# Altium project CW308T_MPC57.PrjPcb
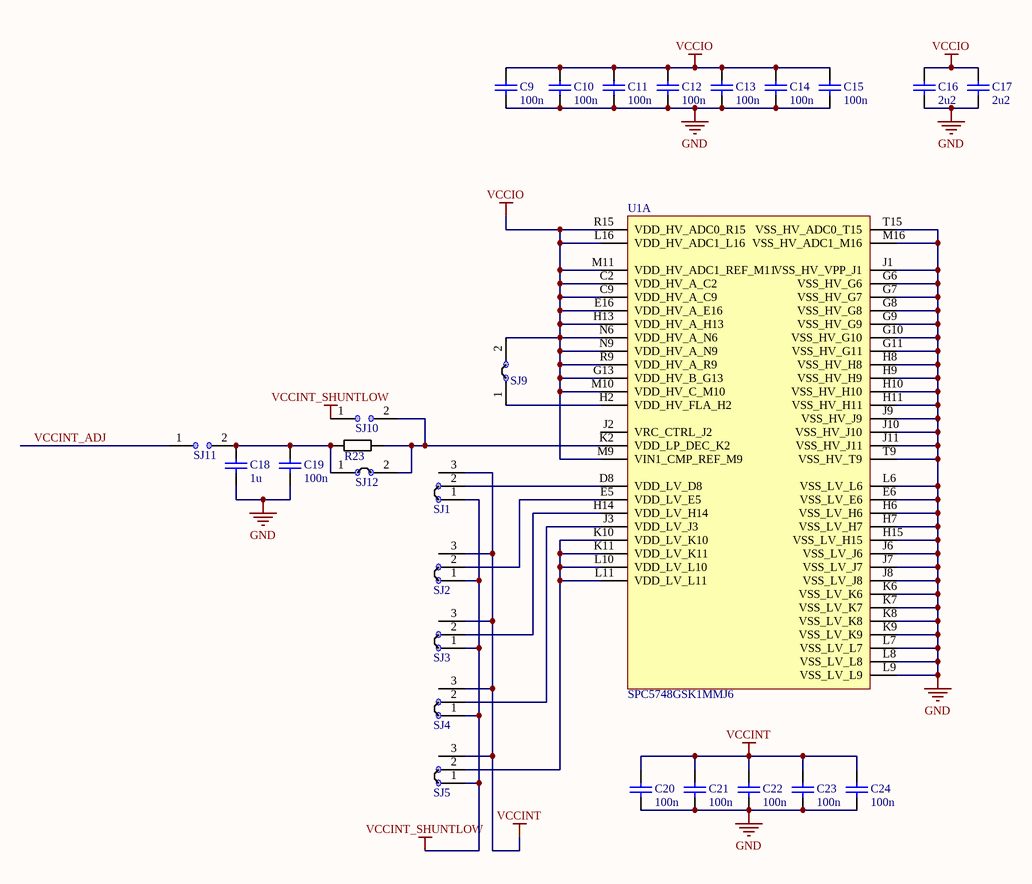
[diagram p0: mpc57_mcupower.SchDoc]
PrjLicense: GPL; PrjName: CW308T-MPC5748G; PrjRev: 02
6 sheets, 90 parts. Net scope: global (net labels, ports and power ports of the same name join across sheets).
Board file: CW308T_MPC57.PcbDoc
Sheets:
  mpc57_mcupower.SchDoc
  mpc57_cwconn.SchDoc
  mpc57_can.SchDoc
  mpc57_cpuio1.SchDoc
  mpc57_cpuio2.SchDoc
  mpc57_clk.SchDoc

## Sheet mpc57_mcupower.SchDoc: MCU Power
size Letter; Organization: NewAE Technology Inc.; Address1: 1083 Queen St., Suite 196; Address2: Halifax; Address3: NS; Address4: Canada B3H 0B2; SheetApproved: YES

### Parts
C9  100n  [CAPC0402_M]
C10  100n  [CAPC0402_M]
C11  100n  [CAPC0402_M]
C12  100n  [CAPC0402_M]
C13  100n  [CAPC0402_M]
C14  100n  [CAPC0402_M]
C15  100n  [CAPC0402_M]
C16  2u2  [CAPC0603_M]
C17  2u2  [CAPC0603_M]
C18  1u  [CAPC0603_M]
C19  100n  [CAPC0402_M]
C20  100n  [CAPC0402_M]
C21  100n  [CAPC0402_M]
C22  100n  [CAPC0402_M]
C23  100n  [CAPC0402_M]
C24  100n  [CAPC0402_M]
R23  1R0  [RESC1608X55N]  (value not drawn)
SJ1  NC  [SJ_3S_NC12]  (value not drawn)  (no BOM)
SJ2  NC  [SJ_3S_NC12]  (value not drawn)  (no BOM)
SJ3  NC  [SJ_3S_NC12]  (value not drawn)  (no BOM)
SJ4  NC  [SJ_3S_NC12]  (value not drawn)  (no BOM)
SJ5  NC  [SJ_3S_NC12]  (value not drawn)  (no BOM)
SJ9  NC  [SJ_2S_NC]  (value not drawn)  (no BOM)
SJ10  NO  [SJ_2S_NO]  (value not drawn)  (no BOM)
SJ11  NO  [SJ_2S_NO]  (value not drawn)  (no BOM)
SJ12  NC  [SJ_2S_NC]  (value not drawn)  (no BOM)
U1  SPC5748GSK1MMJ6  [BGA256C100P16X16_1700X1700X170]  (part A of 5)

### Nets
GND: C9.2 C10.2 C11.2 C12.2 C13.2 C14.2 C15.2 C16.2 C17.2 C18.2 C19.2 C20.2 C21.2 C22.2 C23.2 C24.2 U1.E6(VSS_LV_E6) U1.G6(VSS_HV_G6) U1.G7(VSS_HV_G7) U1.G8(VSS_HV_G8) U1.G9(VSS_HV_G9) U1.G10(VSS_HV_G10) U1.G11(VSS_HV_G11) U1.H6(VSS_LV_H6) U1.H7(VSS_LV_H7) U1.H8(VSS_HV_H8) U1.H9(VSS_HV_H9) U1.H10(VSS_HV_H10) U1.H11(VSS_HV_H11) U1.H15(VSS_LV_H15) U1.J1(VSS_HV_VPP_J1) U1.J6(VSS_LV_J6) U1.J7(VSS_LV_J7) U1.J8(VSS_LV_J8) U1.J9(VSS_HV_J9) U1.J10(VSS_HV_J10) U1.J11(VSS_HV_J11) U1.K6(VSS_LV_K6) U1.K7(VSS_LV_K7) U1.K8(VSS_LV_K8) U1.K9(VSS_LV_K9) U1.L6(VSS_LV_L6) U1.L7(VSS_LV_L7) U1.L8(VSS_LV_L8) U1.L9(VSS_LV_L9) U1.M16(VSS_HV_ADC1_M16) U1.T9(VSS_HV_T9) U1.T15(VSS_HV_ADC0_T15)
VCCINT: C20.1 C21.1 C22.1 C23.1 C24.1 SJ1.3 SJ2.3 SJ3.3 SJ4.3 SJ5.3
VCCINT_SHUNTLOW: SJ1.1 SJ2.1 SJ3.1 SJ4.1 SJ5.1 SJ10.1
VCCIO: C9.1 C10.1 C11.1 C12.1 C13.1 C14.1 C15.1 C16.1 C17.1 SJ9.2 U1.C2(VDD_HV_A_C2) U1.C9(VDD_HV_A_C9) U1.E16(VDD_HV_A_E16) U1.G13(VDD_HV_B_G13) U1.H13(VDD_HV_A_H13) U1.L16(VDD_HV_ADC1_L16) U1.M9(VIN1_CMP_REF_M9) U1.M10(VDD_HV_C_M10) U1.M11(VDD_HV_ADC1_REF_M11) U1.N6(VDD_HV_A_N6) U1.N9(VDD_HV_A_N9) U1.R9(VDD_HV_A_R9) U1.R15(VDD_HV_ADC0_R15)
VCCINT_ADJ: SJ11.1
NetC18_1: C18.1 C19.1 R23.1 SJ11.2 SJ12.1
NetR23_2: R23.2 SJ10.2 SJ12.2 U1.K2(VDD_LP_DEC_K2)
NetSJ1_2: SJ1.2 U1.D8(VDD_LV_D8)
NetSJ2_2: SJ2.2 U1.E5(VDD_LV_E5)
NetSJ3_2: SJ3.2 U1.H14(VDD_LV_H14)
NetSJ4_2: SJ4.2 U1.J3(VDD_LV_J3)
NetSJ5_2: SJ5.2 U1.K10(VDD_LV_K10) U1.K11(VDD_LV_K11) U1.L10(VDD_LV_L10) U1.L11(VDD_LV_L11)
NetSJ9_1: SJ9.1 U1.H2(VDD_HV_FLA_H2)

Not connected (* = marked no-connect by the designer): U1 J2(VRC_CTRL_J2)

### Notes on the sheet
- Title:
- Date:
- Rev:
- Time:
- Project:
- Sheet
- of
- License:
- Copyright © NewAE Technology Inc.
- Approved:
- NewAE.com
- File:

### Library data of the parts
C9-C15 C19-C24 = CCHIP-100n-0402: 100n, 0402; Case-EIA: 0402; Part Number: CCHIP-100n-0402; Component Kind: Standard; Component Type: Standard; Footprint: 0402; Pin Count: 2; Value: 100n; Mounting Technology: SMT
C16 C17 = CCHIP-2u2-0603: 2u2, 0603; Case-EIA: 0603; Case-Metric: 1608; Part Number: CCHIP-2u2-0603; Component Kind: Standard; Component Type: Standard; Footprint: 0603; Pin Count: 2; Value: 2u2; Mounting Technology: SMT
C18 = CCHIP-1u-0603: 1u, 0603; Case-EIA: 0603; Case-Metric: 1608; Part Number: CCHIP-1u-0603; Component Kind: Standard; Component Type: Standard; Footprint: 0603; Pin Count: 2; Value: 1u; Mounting Technology: SMT
R23 = RCHIP-1R0-0603: 1R0 res, 0603, 1%, 1/10W; Manufacture 1: Yageo; Manufacture Part Number 1: RC0603FR-071RL; Case-EIA: 0603; Case-Metric: 1608; Rated Power: 0.1W; Rated Voltage: 75VDC; Part Number: RCHIP-1R0-0603; Component Kind: Standard; Component Type: Standard; Footprint: 0603; Pin Count: 2; Supplier 1: Digi-Key; Supplier Part Number 1: 311-1.00HRCT-ND; Value: 1R0; Tolerance: 1%; Mounting Technology: SMT; Temperature Range: -55C to 155C
SJ1-SJ5 = SJ_3S_12JMP: Solder Jumper, NC; Part Number: SJ_3S_12JMP; Component Type: Standard (No BOM); Pin Count: 3
SJ9 SJ12 = SJ_2S: Solder Jumper, NC; Part Number: SJ_2S; Component Type: Standard (No BOM); Pin Count: 2
SJ10 SJ11 = SJ_2S_NO: Solder Jumper, NO; Part Number: SJ_2S_NO; Component Type: Standard (No BOM); Pin Count: 2; Mounting Technology: COPPER
U1 = SPC5748GSK1MMJ6: Freescale 32-bit MCU, Triple core, 6MB Flash, 160MHz, -40/+125degC, Automotive Qualified, BGA 256

## Sheet mpc57_cwconn.SchDoc: CW308 UFO Connectors
size Letter; Organization: NewAE Technology Inc.; Address1: 1083 Queen St., Suite 196; Address2: Halifax; Address3: NS; Address4: Canada B3H 0B2; SheetApproved: YES
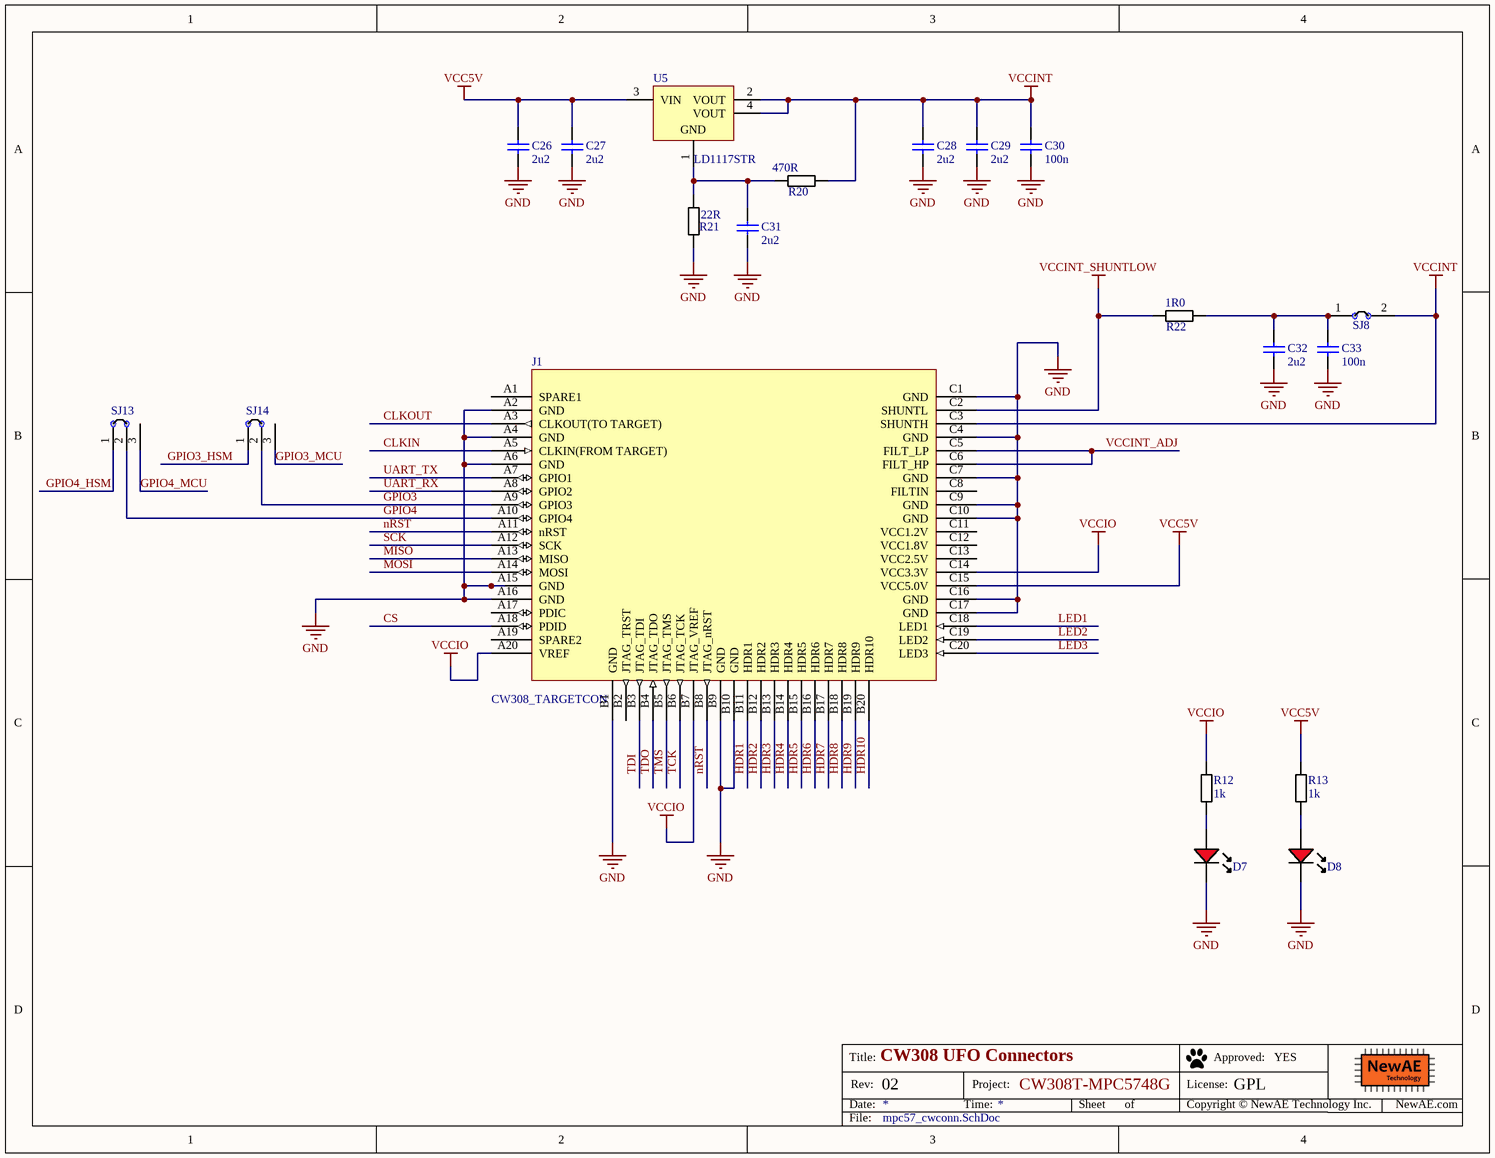
[diagram p1: mpc57_cwconn.SchDoc]

### Parts
C26  2u2  [CAPC0603_M]
C27  2u2  [CAPC0603_M]
C28  2u2  [CAPC0603_M]
C29  2u2  [CAPC0603_M]
C30  100n  [CAPC0402_M]
C31  2u2  [CAPC0603_M]
C32  2u2  [CAPC0603_M]
C33  100n  [CAPC0402_M]
D7  LED, 0603, Red  [LED-0603-RED]  (value not drawn)
D8  LED, 0603, Red  [LED-0603-RED]  (value not drawn)
J1  CW308_TARGETCON  [CW308_TBOARD_CONN]
R12  1k  [RESC1608X55N]
R13  1k  [RESC1608X55N]
R20  470R  [RESC1608X55N]
R21  22R  [RESC1608X55N]
R22  1R0  [RESC2012X70N]
SJ8  NC  [SJ_2S_NC]  (value not drawn)  (no BOM)
SJ13  NC  [SJ_3S_NC12]  (value not drawn)  (no BOM)
SJ14  NC  [SJ_3S_NC12]  (value not drawn)  (no BOM)
U5  LD1117STR  [SOT-223_L]

### Nets
GND: C26.2 C27.2 C28.2 C29.2 C30.2 C31.2 C32.2 C33.2 D7.K D8.K J1.A2(GND) J1.A4(GND) J1.A6(GND) J1.A15(GND) J1.A16(GND) J1.B1(GND) J1.B9(GND) J1.B10(GND) J1.C1(GND) J1.C4(GND) J1.C7(GND) J1.C9(GND) J1.C10(GND) J1.C16(GND) J1.C17(GND) R21.2
VCC5V: C26.1 C27.1 J1.C15(VCC5.0V) R13.1 U5.3(VIN)
VCCINT: C28.1 C29.1 C30.1 J1.C3(SHUNTH) R20.1 SJ8.2 U5.2(VOUT) U5.4(VOUT)
VCCINT_SHUNTLOW: J1.C2(SHUNTL) R22.1
VCCIO: J1.A20(VREF) J1.B7(JTAG_VREF) J1.C14(VCC3.3V) R12.1
CLKIN: J1.A5(CLKIN(FROM_TARGET))
CLKOUT: J1.A3(CLKOUT(TO_TARGET))
CS: J1.A18(PDID)
GPIO3: J1.A9(GPIO3) SJ14.2
GPIO3_HSM: SJ14.1
GPIO3_MCU: SJ14.3
GPIO4: J1.A10(GPIO4) SJ13.2
GPIO4_HSM: SJ13.1
GPIO4_MCU: SJ13.3
HDR1: J1.B11(HDR1)
HDR2: J1.B12(HDR2)
HDR3: J1.B13(HDR3)
HDR4: J1.B14(HDR4)
HDR5: J1.B15(HDR5)
HDR6: J1.B16(HDR6)
HDR7: J1.B17(HDR7)
HDR8: J1.B18(HDR8)
HDR9: J1.B19(HDR9)
HDR10: J1.B20(HDR10)
LED1: J1.C18(LED1)
LED2: J1.C19(LED2)
LED3: J1.C20(LED3)
MISO: J1.A13(MISO)
MOSI: J1.A14(MOSI)
nRST: J1.A11(nRST) J1.B8(JTAG_nRST)
SCK: J1.A12(SCK)
TCK: J1.B6(JTAG_TCK)
TDI: J1.B3(JTAG_TDI)
TDO: J1.B4(JTAG_TDO)
TMS: J1.B5(JTAG_TMS)
UART_RX: J1.A8(GPIO2)
UART_TX: J1.A7(GPIO1)
VCCINT_ADJ: J1.C5(FILT_LP) J1.C6(FILT_HP)
NetC31_1: C31.1 R20.2 R21.1 U5.1(GND)
NetC32_1: C32.1 C33.1 R22.2 SJ8.1
NetD7_A: D7.A R12.2
NetD8_A: D8.A R13.2

Not connected (* = marked no-connect by the designer): J1 A1(SPARE1) A17(PDIC) A19(SPARE2) B2(JTAG_TRST) C8(FILTIN) C11(VCC1.2V) C12(VCC1.8V) C13(VCC2.5V)

### Notes on the sheet
- Title:
- Date:
- Rev:
- Time:
- Project:
- Sheet
- of
- License:
- Copyright © NewAE Technology Inc.
- Approved:
- NewAE.com
- File:

### Library data of the parts
C26-C29 C31 C32 = CCHIP-2u2-0603: as C16 on sheet mpc57_mcupower; Part Number: CCHIP-2u2-0603; Component Kind: Standard; Component Type: Standard; Footprint: 0603; Pin Count: 2; Value: 2u2; Mounting Technology: SMT
C30 C33 = CCHIP-100n-0402: 100n, 0402; Case-EIA: 0402; Part Number: CCHIP-100n-0402; Component Kind: Standard; Component Type: Standard; Footprint: 0402; Pin Count: 2; Value: 100n; Mounting Technology: SMT
D7 D8 = LEDCHIP_0603_RED: Chip LED, Red; Part Number: LEDCHIP_0603_RED; Component Kind: Standard; Component Type: Standard; Pin Count: 2; Mounting Technology: SMT
J1 = CW308_TBOARD: CW308 "Standard" Target Board Connector
R12 R13 = RCHIP-1K-0603: 1k res, 0603, 1%, 1/10W; Manufacture 1: Yageo; Manufacture Part Number 1: RC0603FR-071KL; Case-EIA: 0603; Case-Metric: 1608; Rated Power: 0.1W; Rated Voltage: 75VDC; Part Number: RCHIP-1K-0603; Component Kind: Standard; Component Type: Standard; Footprint: 0603; Pin Count: 2; Supplier 1: Digi-Key; Supplier Part Number 1: 311-1.00KHRCT-ND; Value: 1k; Tolerance: 1%; Mounting Technology: SMT; Temperature Range: -55C to 155C
R20 = RCHIP-120R-0603: 470R res, 0603, 1%, 1/10W; Manufacture 1: Yageo; Manufacture Part Number 1: RC0603FR-07470RL; Case-EIA: 0603; Case-Metric: 1608; Rated Power: 0.1W; Rated Voltage: 75VDC; Part Number: RCHIP-120R-0603; Component Kind: Standard; Component Type: Standard; Footprint: 0603; Pin Count: 2; Supplier 1: Digi-Key; Supplier Part Number 1: 311-470HRCT-ND; Value: 470R; Tolerance: 1%; Mounting Technology: SMT; Temperature Range: -55C to 155C
R21 = RCHIP-120R-0603: 120R res, 0603, 1%, 1/10W; Manufacture 1: Yageo; Manufacture Part Number 1: RC0603FR-0722RL; Case-EIA: 0603; Case-Metric: 1608; Rated Power: 0.1W; Rated Voltage: 75VDC; Part Number: RCHIP-120R-0603; Component Kind: Standard; Component Type: Standard; Footprint: 0603; Pin Count: 2; Supplier 1: Digi-Key; Supplier Part Number 1: 311-22HRCT-ND; Value: 22R; Tolerance: 1%; Mounting Technology: SMT; Temperature Range: -55C to 155C
R22 = RCHIP-1R0-0805: 1R0 res, 0805, 1%, 1/8W; Manufacture 1: Yageo; Manufacture Part Number 1: RC0805FR-071RL; Case-EIA: 0805; Rated Power: 0.125W; Rated Voltage: 75VDC; Part Number: RCHIP-1R0-0805; Component Kind: Standard; Component Type: Standard; Footprint: 0805; Pin Count: 2; Supplier 1: Digi-Key; Supplier Part Number 1: 311-1.00CRCT-ND; Value: 1R0; Tolerance: 1%; Mounting Technology: SMT; Temperature Range: -55C to 155C
SJ8 = SJ_2S: Solder Jumper, NC; Part Number: SJ_2S; Component Type: Standard (No BOM); Pin Count: 2
SJ13 SJ14 = SJ_3S_12JMP: Solder Jumper, NC; Component Group: PCB Feature; Part Number: SJ_3S_12JMP; Pin Count: 3; Mounting Technology: COPPER; Component Type: Standard (No BOM)
U5 = CMP-0244-00313-1: Adjustable Low Drop Voltage Regulator, 1.25 to 15V, 4-Pin SOT-223, Tape and Reel; ComponentLink2Description: Datasheet; PackageVersion: 2010; PackageReference: SOT-223; ComponentLink2URL: http://www.st.com/internet/com/TECHNICAL_RESOURCES/TECHNICAL_LITERATURE/DATASHEET/CD00000544.pdf; DatasheetVersion: 1/11/2011; ComponentLink1URL: http://www.st.com; PackageDescription: 4-Pin SOT-223 Package, 6.5 x 3.5 mm Body, 2.3 mm Pitch, 7 mm Lead Span; ComponentLink1Description: Manufacturer URL; Supplier 1: Digi-Key; Supplier Part Number 1: 497-1244-1-ND

## Sheet mpc57_can.SchDoc: CAN Transceivers
size Letter; Organization: NewAE Technology Inc.; Address1: 1083 Queen St., Suite 196; Address2: Halifax; Address3: NS; Address4: Canada B3H 0B2; SheetApproved: YES
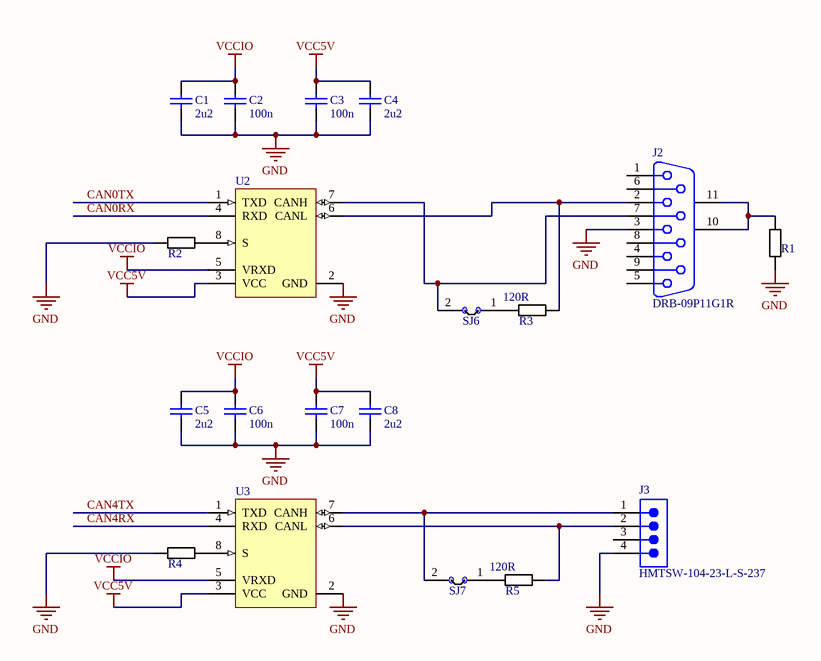
[diagram p2: mpc57_can.SchDoc]

### Parts
C1  2u2  [CAPC0603_M]
C2  100n  [CAPC0402_M]
C3  100n  [CAPC0402_M]
C4  2u2  [CAPC0603_M]
C5  2u2  [CAPC0603_M]
C6  100n  [CAPC0402_M]
C7  100n  [CAPC0402_M]
C8  2u2  [CAPC0603_M]
J2  DRB-09P11G1R  [TAIT-DRB-09P11G1R_V]
J3  HMTSW-104-23-L-S-237  [SMTC-HMTSW-104-23-X-S-237]
R1  10R  [RESC1608X55N]  (value not drawn)
R2  4k7  [RESC1608X55N]  (value not drawn)
R3  120R  [RESC1608X55N]
R4  4k7  [RESC1608X55N]  (value not drawn)
R5  120R  [RESC1608X55N]
SJ6  NC  [SJ_2S_NC]  (value not drawn)  (no BOM)
SJ7  NC  [SJ_2S_NC]  (value not drawn)  (no BOM)
U2  TJA1051T/3  [SOIC8_NARROW]  (value not drawn)
U3  TJA1051T/3  [SOIC8_NARROW]  (value not drawn)

### Nets
GND: C1.2 C2.2 C3.2 C4.2 C5.2 C6.2 C7.2 C8.2 J2.3 J3.4 R1.1 R2.1 R4.1 U2.2(GND) U3.2(GND)
VCC5V: C3.1 C4.1 C7.1 C8.1 U2.3(VCC) U3.3(VCC)
VCCIO: C1.1 C2.1 C5.1 C6.1 U2.5(VRXD) U3.5(VRXD)
CAN0RX: U2.4(RXD)
CAN0TX: U2.1(TXD)
CAN4RX: U3.4(RXD)
CAN4TX: U3.1(TXD)
NetJ2_2: J2.2 R3.2 U2.6(CANL)
NetJ2_7: J2.7 SJ6.2 U2.7(CANH)
NetJ2_10: J2.10(MH1) J2.11(MH2) R1.2
NetJ3_1: J3.1 SJ7.2 U3.7(CANH)
NetJ3_2: J3.2 R5.2 U3.6(CANL)
NetR2_2: R2.2 U2.8(S)
NetR3_1: R3.1 SJ6.1
NetR4_2: R4.2 U3.8(S)
NetR5_1: R5.1 SJ7.1

Not connected (* = marked no-connect by the designer): J2 1 4 5 6 8 9; J3 3

### Notes on the sheet
- Title:
- Date:
- Rev:
- Time:
- Project:
- Sheet
- of
- License:
- Copyright © NewAE Technology Inc.
- Approved:
- NewAE.com
- File:

### Library data of the parts
C1 C4 C5 C8 = CCHIP-2u2-0603: as C16 on sheet mpc57_mcupower; Part Number: CCHIP-2u2-0603; Component Kind: Standard; Component Type: Standard; Footprint: 0603; Pin Count: 2; Value: 2u2; Mounting Technology: SMT
C2 C3 C6 C7 = CCHIP-100n-0402: 100n, 0402; Case-EIA: 0402; Part Number: CCHIP-100n-0402; Component Kind: Standard; Component Type: Standard; Footprint: 0402; Pin Count: 2; Value: 100n; Mounting Technology: SMT
J2 = CMP-0264-00001-1: DB9 R/A Connector, Through-hole, Male; ComponentLink1URL: http://www.taitek.com/; ComponentLink2URL: http://www.taitek.com/connects_prod_info.asp?id=A100011; PartNumber: DRB-09P11G1R; PackageDescription: 9-Pin D-Sub R/A  Male Connector, 2.77 mm Pitch; ComponentLink2Description: Datasheet; Mounting Technology: Through Hole; PackageReference: DRB-09P11G1R; ComponentLink1Description: Manufacturer URL
J3 = CMP-1024-00020-1: Manufacturer: Samtec; Pitch: 2.54 mm; ComponentLink3URL: http://www.samtec.com/documents/webfiles/cpdf/HMTSW-XXX-XX-X-X-XXXX-XX-XX-MKT1.pdf; PartNumber: HMTSW-104-23-L-S-237; Temperature Range: -55 to 125 degC; ComponentLink1Description: Manufacturer URL; Orientation: Vertical; ComponentLink3Description: Package Specification; ComponentLink2URL: http://www.samtec.com/documents/webfiles/pdf/HMTSW.PDF; DatasheetVersion: F-214; PackageDescription: Assembly .025 [.64] SQ. Post Hi-Temp Terminal Strip; ComponentLink1URL: http://www.samtec.com; PackageReference: HMTSW-104-23-X-S-237; RoHS: True; Mounting Technology: Through-hole; ComponentLink2Description: Datasheet; PackageVersion: AL, 3/1987
R1 = RCHIP-10R-0603: 10R res, 0603, 1%, 1/10W; Manufacture 1: Yageo; Manufacture Part Number 1: RC0603FR-0710RL; Case-EIA: 0603; Case-Metric: 1608; Rated Power: 0.1W; Rated Voltage: 75VDC; Part Number: RCHIP-10R-0603; Component Kind: Standard; Component Type: Standard; Footprint: 0603; Pin Count: 2; Supplier 1: Digi-Key; Supplier Part Number 1: 311-10.0HRCT-ND; Value: 10R; Tolerance: 1%; Mounting Technology: SMT; Temperature Range: -55C to 155C
R2 R4 = RCHIP-4K7-0603: 4k7 res, 0603, 1%, 1/10W; Manufacture 1: Yageo; Manufacture Part Number 1: RC0603FR-074K7L; Case-EIA: 0603; Case-Metric: 1608; Rated Power: 0.1W; Rated Voltage: 75VDC; Part Number: RCHIP-4K7-0603; Component Kind: Standard; Component Type: Standard; Footprint: 0603; Pin Count: 2; Supplier 1: Digi-Key; Supplier Part Number 1: 311-4.70KHRCT-ND; Value: 4k7; Tolerance: 1%; Mounting Technology: SMT; Temperature Range: -55C to 155C
R3 R5 = RCHIP-120R-0603: 120R res, 0603, 1%, 1/10W; Manufacture 1: Yageo; Manufacture Part Number 1: RC0603FR-07120RL; Case-EIA: 0603; Case-Metric: 1608; Rated Power: 0.1W; Rated Voltage: 75VDC; Part Number: RCHIP-120R-0603; Component Kind: Standard; Component Type: Standard; Footprint: 0603; Pin Count: 2; Supplier 1: Digi-Key; Supplier Part Number 1: 311-120HRCT-ND; Value: 120R; Tolerance: 1%; Mounting Technology: SMT; Temperature Range: -55C to 155C
SJ6 SJ7 = SJ_2S: Solder Jumper, NC; Part Number: SJ_2S; Component Type: Standard (No BOM); Pin Count: 2
U2 U3 = TJA1051T_3: CAN-FD Transceiver, 3.3V; Part Number: TJA1051T_3; Component Kind: Standard; Component Type: Standard; Footprint: SOIC8-NARROW; Pin Count: 8; Supplier 1: Digi-Key; Supplier Part Number 1: 568-8684-1-ND; ComponentLink1Description: Datasheet; ComponentLink1URL: http://www.nxp.com/documents/data_sheet/TJA1051.pdf; Mounting Technology: Surface Mount

## Sheet mpc57_cpuio1.SchDoc: CPU I/O Bank 1
size Letter; Organization: NewAE Technology Inc.; Address1: 1083 Queen St., Suite 196; Address2: Halifax; Address3: NS; Address4: Canada B3H 0B2; SheetApproved: YES
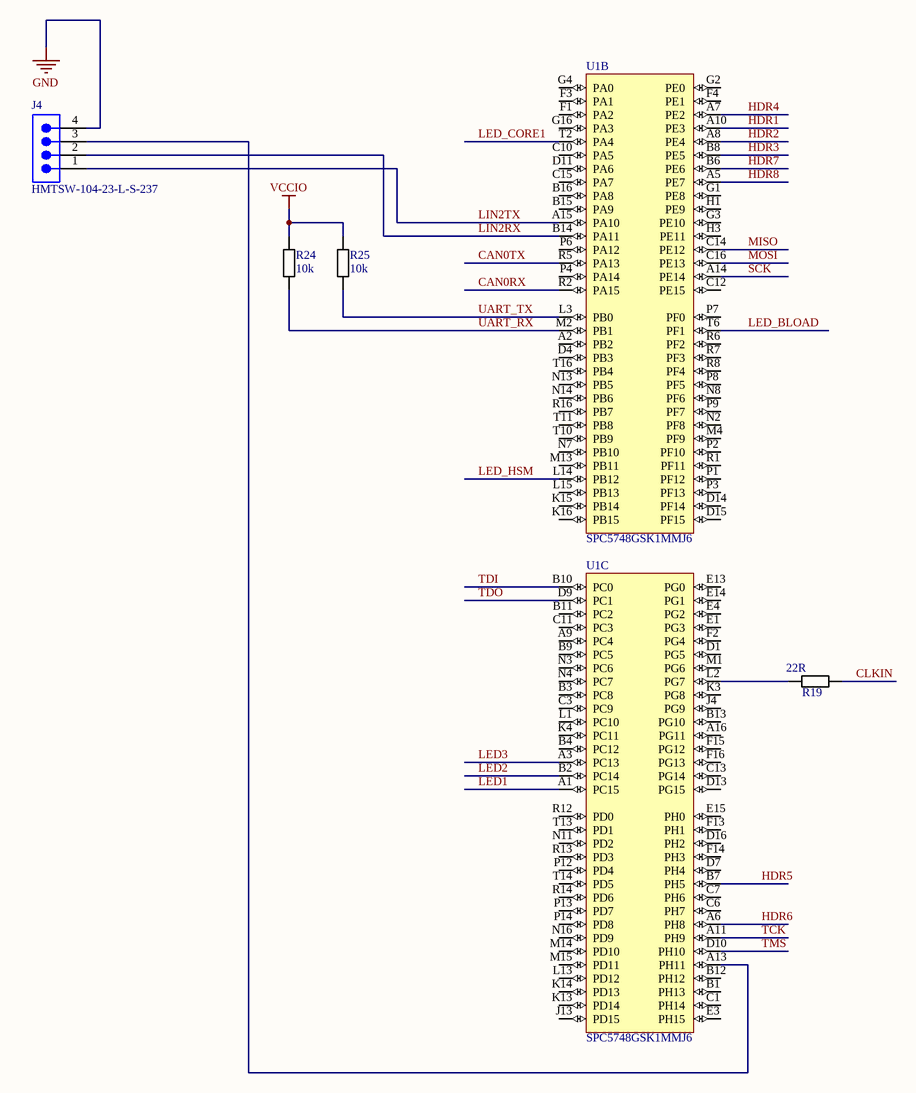
[diagram p3: mpc57_cpuio1.SchDoc]

### Parts
J4  HMTSW-104-23-L-S-237  [SMTC-HMTSW-104-23-X-S-237]
R19  22R  [RESC1608X55N]
R24  10k  [RESC1608X55N]
R25  10k  [RESC1608X55N]
U1  SPC5748GSK1MMJ6  [BGA256C100P16X16_1700X1700X170]  (parts B,C of 5)

### Nets
GND: J4.4
VCCIO: R24.1 R25.1
CAN0RX: U1.R2(PA15)
CAN0TX: U1.R5(PA13)
CLKIN: R19.2
HDR1: U1.A10(PE3)
HDR2: U1.A8(PE4)
HDR3: U1.B8(PE5)
HDR4: U1.A7(PE2)
HDR5: U1.B7(PH5)
HDR6: U1.A6(PH8)
HDR7: U1.B6(PE6)
HDR8: U1.A5(PE7)
LED1: U1.A1(PC15)
LED2: U1.B2(PC14)
LED3: U1.A3(PC13)
LED_BLOAD: U1.T6(PF1)
LED_CORE1: U1.T2(PA4)
LED_HSM: U1.L14(PB12)
LIN2RX: J4.2 U1.B14(PA11)
LIN2TX: J4.1 U1.A15(PA10)
MISO: U1.C14(PE12)
MOSI: U1.C16(PE13)
SCK: U1.A14(PE14)
TCK: U1.A11(PH9)
TDI: U1.B10(PC0)
TDO: U1.D9(PC1)
TMS: U1.D10(PH10)
UART_RX: R24.2 U1.M2(PB1)
UART_TX: R25.2 U1.L3(PB0)
NetJ4_3: J4.3 U1.A13(PH11)
NetR19_1: R19.1 U1.L2(PG7)

Not connected (* = marked no-connect by the designer): U1 A2(PB2) A9(PC4) A16(PG11) B1(PH13) B3(PC8) B4(PC12) B9(PC5) B11(PC2) B12(PH12) B13(PG10) B15(PA9) B16(PA8) C1(PH14) C3(PC9) C6(PH7) C7(PH6) C10(PA5) C11(PC3) C12(PE15) C13(PG14) C15(PA7) D1(PG5) D4(PB3) D7(PH4) D11(PA6) D13(PG15) D14(PF14) D15(PF15) D16(PH2) E1(PG3) E3(PH15) E4(PG2) E13(PG0) E14(PG1) E15(PH0) F1(PA2) F2(PG4) F3(PA1) F4(PE1) F13(PH1) F14(PH3) F15(PG12) F16(PG13) G1(PE8) G2(PE0) G3(PE10) G4(PA0) G16(PA3) H1(PE9) H3(PE11) J4(PG9) J13(PD15) K3(PG8) K4(PC11) K13(PD14) K14(PD13) K15(PB14) K16(PB15) L1(PC10) L13(PD12) L15(PB13) M1(PG6) M4(PF9) M13(PB11) M14(PD10) M15(PD11) N2(PF8) N3(PC6) N4(PC7) N7(PB10) N8(PF6) N11(PD2) N13(PB5) N14(PB6) N16(PD9) P1(PF12) P2(PF10) P3(PF13) P4(PA14) P6(PA12) P7(PF0) P8(PF5) P9(PF7) P12(PD4) P13(PD7) P14(PD8) R1(PF11) R6(PF2) R7(PF3) R8(PF4) R12(PD0) R13(PD3) R14(PD6) R16(PB7) T10(PB9) T11(PB8) T13(PD1) T14(PD5) T16(PB4)

### Notes on the sheet
- Title:
- Date:
- Rev:
- Time:
- Project:
- Sheet
- of
- License:
- Copyright © NewAE Technology Inc.
- Approved:
- NewAE.com
- File:

### Library data of the parts
J4 = CMP-1024-00020-1: Manufacturer: Samtec; Pitch: 2.54 mm; ComponentLink3URL: http://www.samtec.com/documents/webfiles/cpdf/HMTSW-XXX-XX-X-X-XXXX-XX-XX-MKT1.pdf; PartNumber: HMTSW-104-23-L-S-237; Temperature Range: -55 to 125 degC; ComponentLink1Description: Manufacturer URL; Orientation: Vertical; ComponentLink3Description: Package Specification; ComponentLink2URL: http://www.samtec.com/documents/webfiles/pdf/HMTSW.PDF; DatasheetVersion: F-214; PackageDescription: Assembly .025 [.64] SQ. Post Hi-Temp Terminal Strip; ComponentLink1URL: http://www.samtec.com; PackageReference: HMTSW-104-23-X-S-237; RoHS: True; Mounting Technology: Through-hole; ComponentLink2Description: Datasheet; PackageVersion: AL, 3/1987
R19 = RCHIP-22R-0603: 22R res, 0603, 1%, 1/10W; Manufacture 1: Yageo; Manufacture Part Number 1: RC0603FR-0722RL; Case-EIA: 0603; Case-Metric: 1608; Rated Power: 0.1W; Rated Voltage: 75VDC; Part Number: RCHIP-22R-0603; Component Kind: Standard; Component Type: Standard; Footprint: 0603; Pin Count: 2; Supplier 1: Digi-Key; Supplier Part Number 1: 311-22.0HRCT-ND; Value: 22R; Tolerance: 1%; Mounting Technology: SMT; Temperature Range: -55C to 155C
R24 R25 = RCHIP-10K-0603: 10k res, 0603, 1%, 1/10W; Manufacture 1: Yageo; Manufacture Part Number 1: RC0603FR-0710KL; Case-EIA: 0603; Case-Metric: 1608; Rated Power: 0.1W; Rated Voltage: 75VDC; Part Number: RCHIP-10K-0603; Component Kind: Standard; Component Type: Standard; Footprint: 0603; Pin Count: 2; Supplier 1: Digi-Key; Supplier Part Number 1: 311-10.0KHRCT-ND; Value: 10k; Tolerance: 1%; Mounting Technology: SMT; Temperature Range: -55C to 155C
U1 = SPC5748GSK1MMJ6: as U1 on sheet mpc57_mcupower

## Sheet mpc57_cpuio2.SchDoc: CPU I/O Bank 2
size Letter; Organization: NewAE Technology Inc.; Address1: 1083 Queen St., Suite 196; Address2: Halifax; Address3: NS; Address4: Canada B3H 0B2; SheetApproved: YES
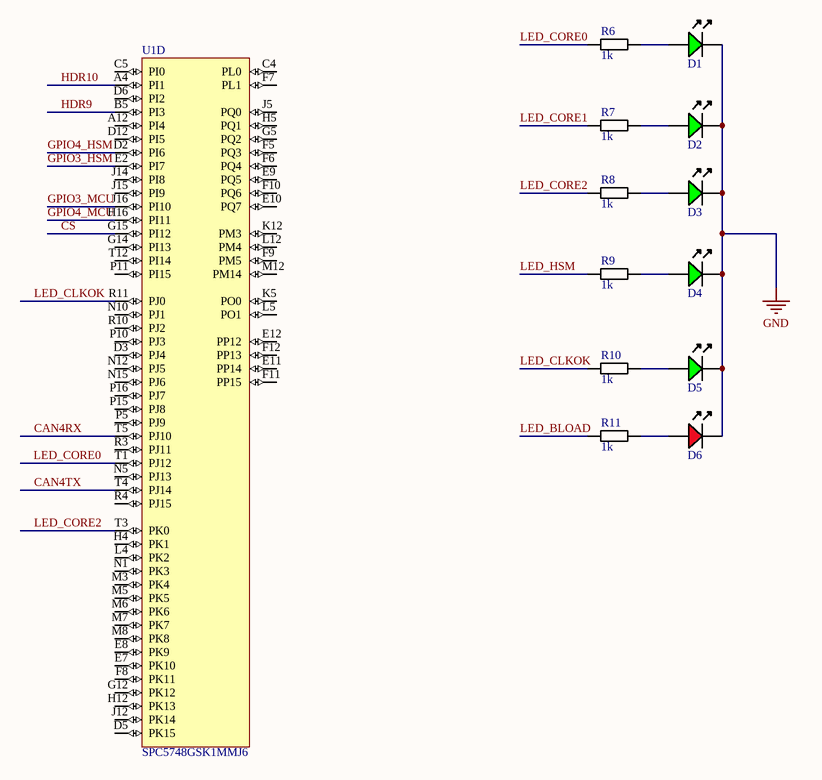
[diagram p4: mpc57_cpuio2.SchDoc]

### Parts
D1  LED, 0603, Green  [LED-0603-GREEN]  (value not drawn)
D2  LED, 0603, Green  [LED-0603-GREEN]  (value not drawn)
D3  LED, 0603, Green  [LED-0603-GREEN]  (value not drawn)
D4  LED, 0603, Green  [LED-0603-GREEN]  (value not drawn)
D5  LED, 0603, Green  [LED-0603-GREEN]  (value not drawn)
D6  LED, 0603, Red  [LED-0603-RED]  (value not drawn)
R6  1k  [RESC1608X55N]
R7  1k  [RESC1608X55N]
R8  1k  [RESC1608X55N]
R9  1k  [RESC1608X55N]
R10  1k  [RESC1608X55N]
R11  1k  [RESC1608X55N]
U1  SPC5748GSK1MMJ6  [BGA256C100P16X16_1700X1700X170]  (part D of 5)

### Nets
GND: D1.K D2.K D3.K D4.K D5.K D6.K
CAN4RX: U1.T5(PJ10)
CAN4TX: U1.T4(PJ14)
CS: U1.G15(PI12)
GPIO3_HSM: U1.E2(PI7)
GPIO3_MCU: U1.J16(PI10)
GPIO4_HSM: U1.D2(PI6)
GPIO4_MCU: U1.H16(PI11)
HDR9: U1.B5(PI3)
HDR10: U1.A4(PI1)
LED_BLOAD: R11.1
LED_CLKOK: R10.1 U1.R11(PJ0)
LED_CORE0: R6.1 U1.T1(PJ12)
LED_CORE1: R7.1
LED_CORE2: R8.1 U1.T3(PK0)
LED_HSM: R9.1
NetD1_A: D1.A R6.2
NetD2_A: D2.A R7.2
NetD3_A: D3.A R8.2
NetD4_A: D4.A R9.2
NetD5_A: D5.A R10.2
NetD6_A: D6.A R11.2

Not connected (* = marked no-connect by the designer): U1 A12(PI4) C4(PL0) C5(PI0) D3(PJ4) D5(PK15) D6(PI2) D12(PI5) E7(PK10) E8(PK9) E9(PQ5) E10(PQ7) E11(PP14) E12(PP12) F5(PQ3) F6(PQ4) F7(PL1) F8(PK11) F9(PM5) F10(PQ6) F11(PP15) F12(PP13) G5(PQ2) G12(PK12) G14(PI13) H4(PK1) H5(PQ1) H12(PK13) J5(PQ0) J12(PK14) J14(PI8) J15(PI9) K5(PO0) K12(PM3) L4(PK2) L5(PO1) L12(PM4) M3(PK4) M5(PK5) M6(PK6) M7(PK7) M8(PK8) M12(PM14) N1(PK3) N5(PJ13) N10(PJ1) N12(PJ5) N15(PJ6) P5(PJ9) P10(PJ3) P11(PI15) P15(PJ8) P16(PJ7) R3(PJ11) R4(PJ15) R10(PJ2) T12(PI14)

### Notes on the sheet
- Title:
- Date:
- Rev:
- Time:
- Project:
- Sheet
- of
- License:
- Copyright © NewAE Technology Inc.
- Approved:
- NewAE.com
- File:

### Library data of the parts
D1-D5 = LEDCHIP_0603_GREEN: Chip LED, Green; Part Number: LEDCHIP_0603_GREEN; Component Kind: Standard; Component Type: Standard; Pin Count: 2; Mounting Technology: SMT
D6 = LEDCHIP_0603_RED: Chip LED, Red; Part Number: LEDCHIP_0603_RED; Component Kind: Standard; Component Type: Standard; Pin Count: 2; Mounting Technology: SMT
R6-R11 = RCHIP-1K-0603: as R12 on sheet mpc57_cwconn; Part Number: RCHIP-1K-0603; Component Kind: Standard; Component Type: Standard; Footprint: 0603; Pin Count: 2; Supplier 1: Digi-Key; Supplier Part Number 1: 311-1.00KHRCT-ND; Value: 1k; Tolerance: 1%; Mounting Technology: SMT; Temperature Range: -55C to 155C
U1 = SPC5748GSK1MMJ6: as U1 on sheet mpc57_mcupower

## Sheet mpc57_clk.SchDoc: Clock/Reset Drivers
size Letter; Organization: NewAE Technology Inc.; Address1: 1083 Queen St., Suite 196; Address2: Halifax; Address3: NS; Address4: Canada B3H 0B2; SheetApproved: YES
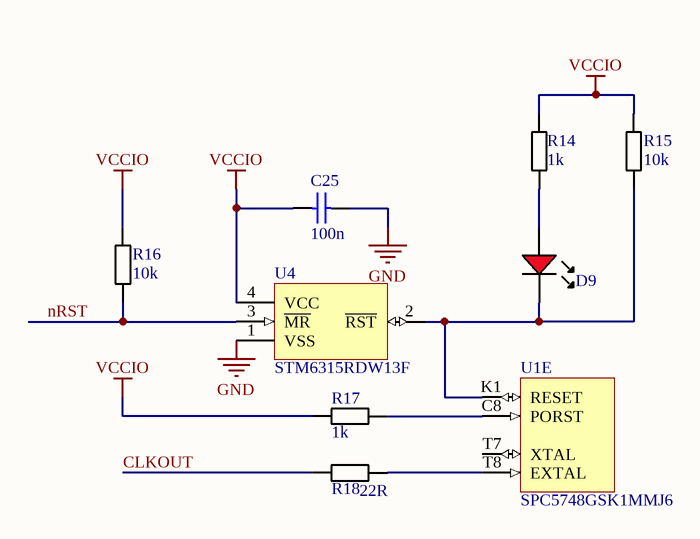
[diagram p5: mpc57_clk.SchDoc]

### Parts
C25  100n  [CAPC0402_M]
D9  LED, 0603, Red  [LED-0603-RED]  (value not drawn)
R14  1k  [RESC1608X55N]
R15  10k  [RESC1608X55N]
R16  10k  [RESC1608X55N]
R17  1k  [RESC1608X55N]
R18  22R  [RESC1608X55N]
U1  SPC5748GSK1MMJ6  [BGA256C100P16X16_1700X1700X170]  (part E of 5)
U4  STM6315RDW13F  [SOT143B]

### Nets
GND: C25.2 U4.1(VSS)
VCCIO: C25.1 R14.1 R15.1 R16.1 R17.1 U4.4(VCC)
CLKOUT: R18.1
nRST: R16.2 U4.3(~{MR})
NetD9_A: D9.A R14.2
NetD9_K: D9.K R15.2 U1.K1(RESET) U4.2(~{RST})
NetR17_2: R17.2 U1.C8(PORST)
NetR18_2: R18.2 U1.T8(EXTAL)

Not connected (* = marked no-connect by the designer): U1 T7(XTAL)

### Notes on the sheet
- Title:
- Date:
- Rev:
- Time:
- Project:
- Sheet
- of
- License:
- Copyright © NewAE Technology Inc.
- Approved:
- NewAE.com
- File:

### Library data of the parts
C25 = CCHIP-100n-0402: 100n, 0402; Case-EIA: 0402; Part Number: CCHIP-100n-0402; Component Kind: Standard; Component Type: Standard; Footprint: 0402; Pin Count: 2; Value: 100n; Mounting Technology: SMT
D9 = LEDCHIP_0603_RED: Chip LED, Red; Part Number: LEDCHIP_0603_RED; Component Kind: Standard; Component Type: Standard; Pin Count: 2; Mounting Technology: SMT
R14 R17 = RCHIP-1K-0603: as R12 on sheet mpc57_cwconn; Part Number: RCHIP-1K-0603; Component Kind: Standard; Component Type: Standard; Footprint: 0603; Pin Count: 2; Supplier 1: Digi-Key; Supplier Part Number 1: 311-1.00KHRCT-ND; Value: 1k; Tolerance: 1%; Mounting Technology: SMT; Temperature Range: -55C to 155C
R15 R16 = RCHIP-10K-0603: as R24 on sheet mpc57_cpuio1; Part Number: RCHIP-10K-0603; Component Kind: Standard; Component Type: Standard; Footprint: 0603; Pin Count: 2; Supplier 1: Digi-Key; Supplier Part Number 1: 311-10.0KHRCT-ND; Value: 10k; Tolerance: 1%; Mounting Technology: SMT; Temperature Range: -55C to 155C
R18 = RCHIP-22R-0603: as R19 on sheet mpc57_cpuio1; Part Number: RCHIP-22R-0603; Component Kind: Standard; Component Type: Standard; Footprint: 0603; Pin Count: 2; Supplier 1: Digi-Key; Supplier Part Number 1: 311-22.0HRCT-ND; Value: 22R; Tolerance: 1%; Mounting Technology: SMT; Temperature Range: -55C to 155C
U1 = SPC5748GSK1MMJ6: as U1 on sheet mpc57_mcupower
U4 = STM6315RDW13F: 2.93V Reset Controller, 112mS; Manufacture 1: ST Microelectronics; Pitch: 1.92mm; Part Number: STM6315RDW13F; Component Kind: Standard; Component Type: Standard; Footprint: SOT-143-4; Manufacture Part Number 1: STM6315RDW13F; Pin Count: 4; Supplier 1: Digi-Key; Supplier Part Number 1: 497-5127-1-ND; Mounting Technology: SMT; RoHS: Yes; Temperature Range: -40C to 125C

## Nets that join several sheets
GND: mpc57_mcupower (48 pins), mpc57_cwconn (26 pins), mpc57_can (15 pins), mpc57_cpuio1 (J4.4), mpc57_cpuio2 (6 pins), mpc57_clk (C25.2 U4.1)
VCC5V: mpc57_cwconn (5 pins), mpc57_can (6 pins)
VCCINT: mpc57_mcupower (10 pins), mpc57_cwconn (8 pins)
VCCINT_SHUNTLOW: mpc57_mcupower (6 pins), mpc57_cwconn (J1.C2 R22.1)
VCCIO: mpc57_mcupower (23 pins), mpc57_cwconn (J1.A20 J1.B7 J1.C14 R12.1), mpc57_can (6 pins), mpc57_cpuio1 (R24.1 R25.1), mpc57_clk (6 pins)
CAN0RX: mpc57_can (U2.4), mpc57_cpuio1 (U1.R2)
CAN0TX: mpc57_can (U2.1), mpc57_cpuio1 (U1.R5)
CAN4RX: mpc57_can (U3.4), mpc57_cpuio2 (U1.T5)
CAN4TX: mpc57_can (U3.1), mpc57_cpuio2 (U1.T4)
CLKIN: mpc57_cwconn (J1.A5), mpc57_cpuio1 (R19.2)
CLKOUT: mpc57_cwconn (J1.A3), mpc57_clk (R18.1)
CS: mpc57_cwconn (J1.A18), mpc57_cpuio2 (U1.G15)
GPIO3_HSM: mpc57_cwconn (SJ14.1), mpc57_cpuio2 (U1.E2)
GPIO3_MCU: mpc57_cwconn (SJ14.3), mpc57_cpuio2 (U1.J16)
GPIO4_HSM: mpc57_cwconn (SJ13.1), mpc57_cpuio2 (U1.D2)
GPIO4_MCU: mpc57_cwconn (SJ13.3), mpc57_cpuio2 (U1.H16)
HDR1: mpc57_cwconn (J1.B11), mpc57_cpuio1 (U1.A10)
HDR2: mpc57_cwconn (J1.B12), mpc57_cpuio1 (U1.A8)
HDR3: mpc57_cwconn (J1.B13), mpc57_cpuio1 (U1.B8)
HDR4: mpc57_cwconn (J1.B14), mpc57_cpuio1 (U1.A7)
HDR5: mpc57_cwconn (J1.B15), mpc57_cpuio1 (U1.B7)
HDR6: mpc57_cwconn (J1.B16), mpc57_cpuio1 (U1.A6)
HDR7: mpc57_cwconn (J1.B17), mpc57_cpuio1 (U1.B6)
HDR8: mpc57_cwconn (J1.B18), mpc57_cpuio1 (U1.A5)
HDR9: mpc57_cwconn (J1.B19), mpc57_cpuio2 (U1.B5)
HDR10: mpc57_cwconn (J1.B20), mpc57_cpuio2 (U1.A4)
LED1: mpc57_cwconn (J1.C18), mpc57_cpuio1 (U1.A1)
LED2: mpc57_cwconn (J1.C19), mpc57_cpuio1 (U1.B2)
LED3: mpc57_cwconn (J1.C20), mpc57_cpuio1 (U1.A3)
LED_BLOAD: mpc57_cpuio1 (U1.T6), mpc57_cpuio2 (R11.1)
LED_CORE1: mpc57_cpuio1 (U1.T2), mpc57_cpuio2 (R7.1)
LED_HSM: mpc57_cpuio1 (U1.L14), mpc57_cpuio2 (R9.1)
MISO: mpc57_cwconn (J1.A13), mpc57_cpuio1 (U1.C14)
MOSI: mpc57_cwconn (J1.A14), mpc57_cpuio1 (U1.C16)
nRST: mpc57_cwconn (J1.A11 J1.B8), mpc57_clk (R16.2 U4.3)
SCK: mpc57_cwconn (J1.A12), mpc57_cpuio1 (U1.A14)
TCK: mpc57_cwconn (J1.B6), mpc57_cpuio1 (U1.A11)
TDI: mpc57_cwconn (J1.B3), mpc57_cpuio1 (U1.B10)
TDO: mpc57_cwconn (J1.B4), mpc57_cpuio1 (U1.D9)
TMS: mpc57_cwconn (J1.B5), mpc57_cpuio1 (U1.D10)
UART_RX: mpc57_cwconn (J1.A8), mpc57_cpuio1 (R24.2 U1.M2)
UART_TX: mpc57_cwconn (J1.A7), mpc57_cpuio1 (R25.2 U1.L3)
VCCINT_ADJ: mpc57_mcupower (SJ11.1), mpc57_cwconn (J1.C5 J1.C6)